# Altium schematic sheet WIF_BT.SchDoc
size A3
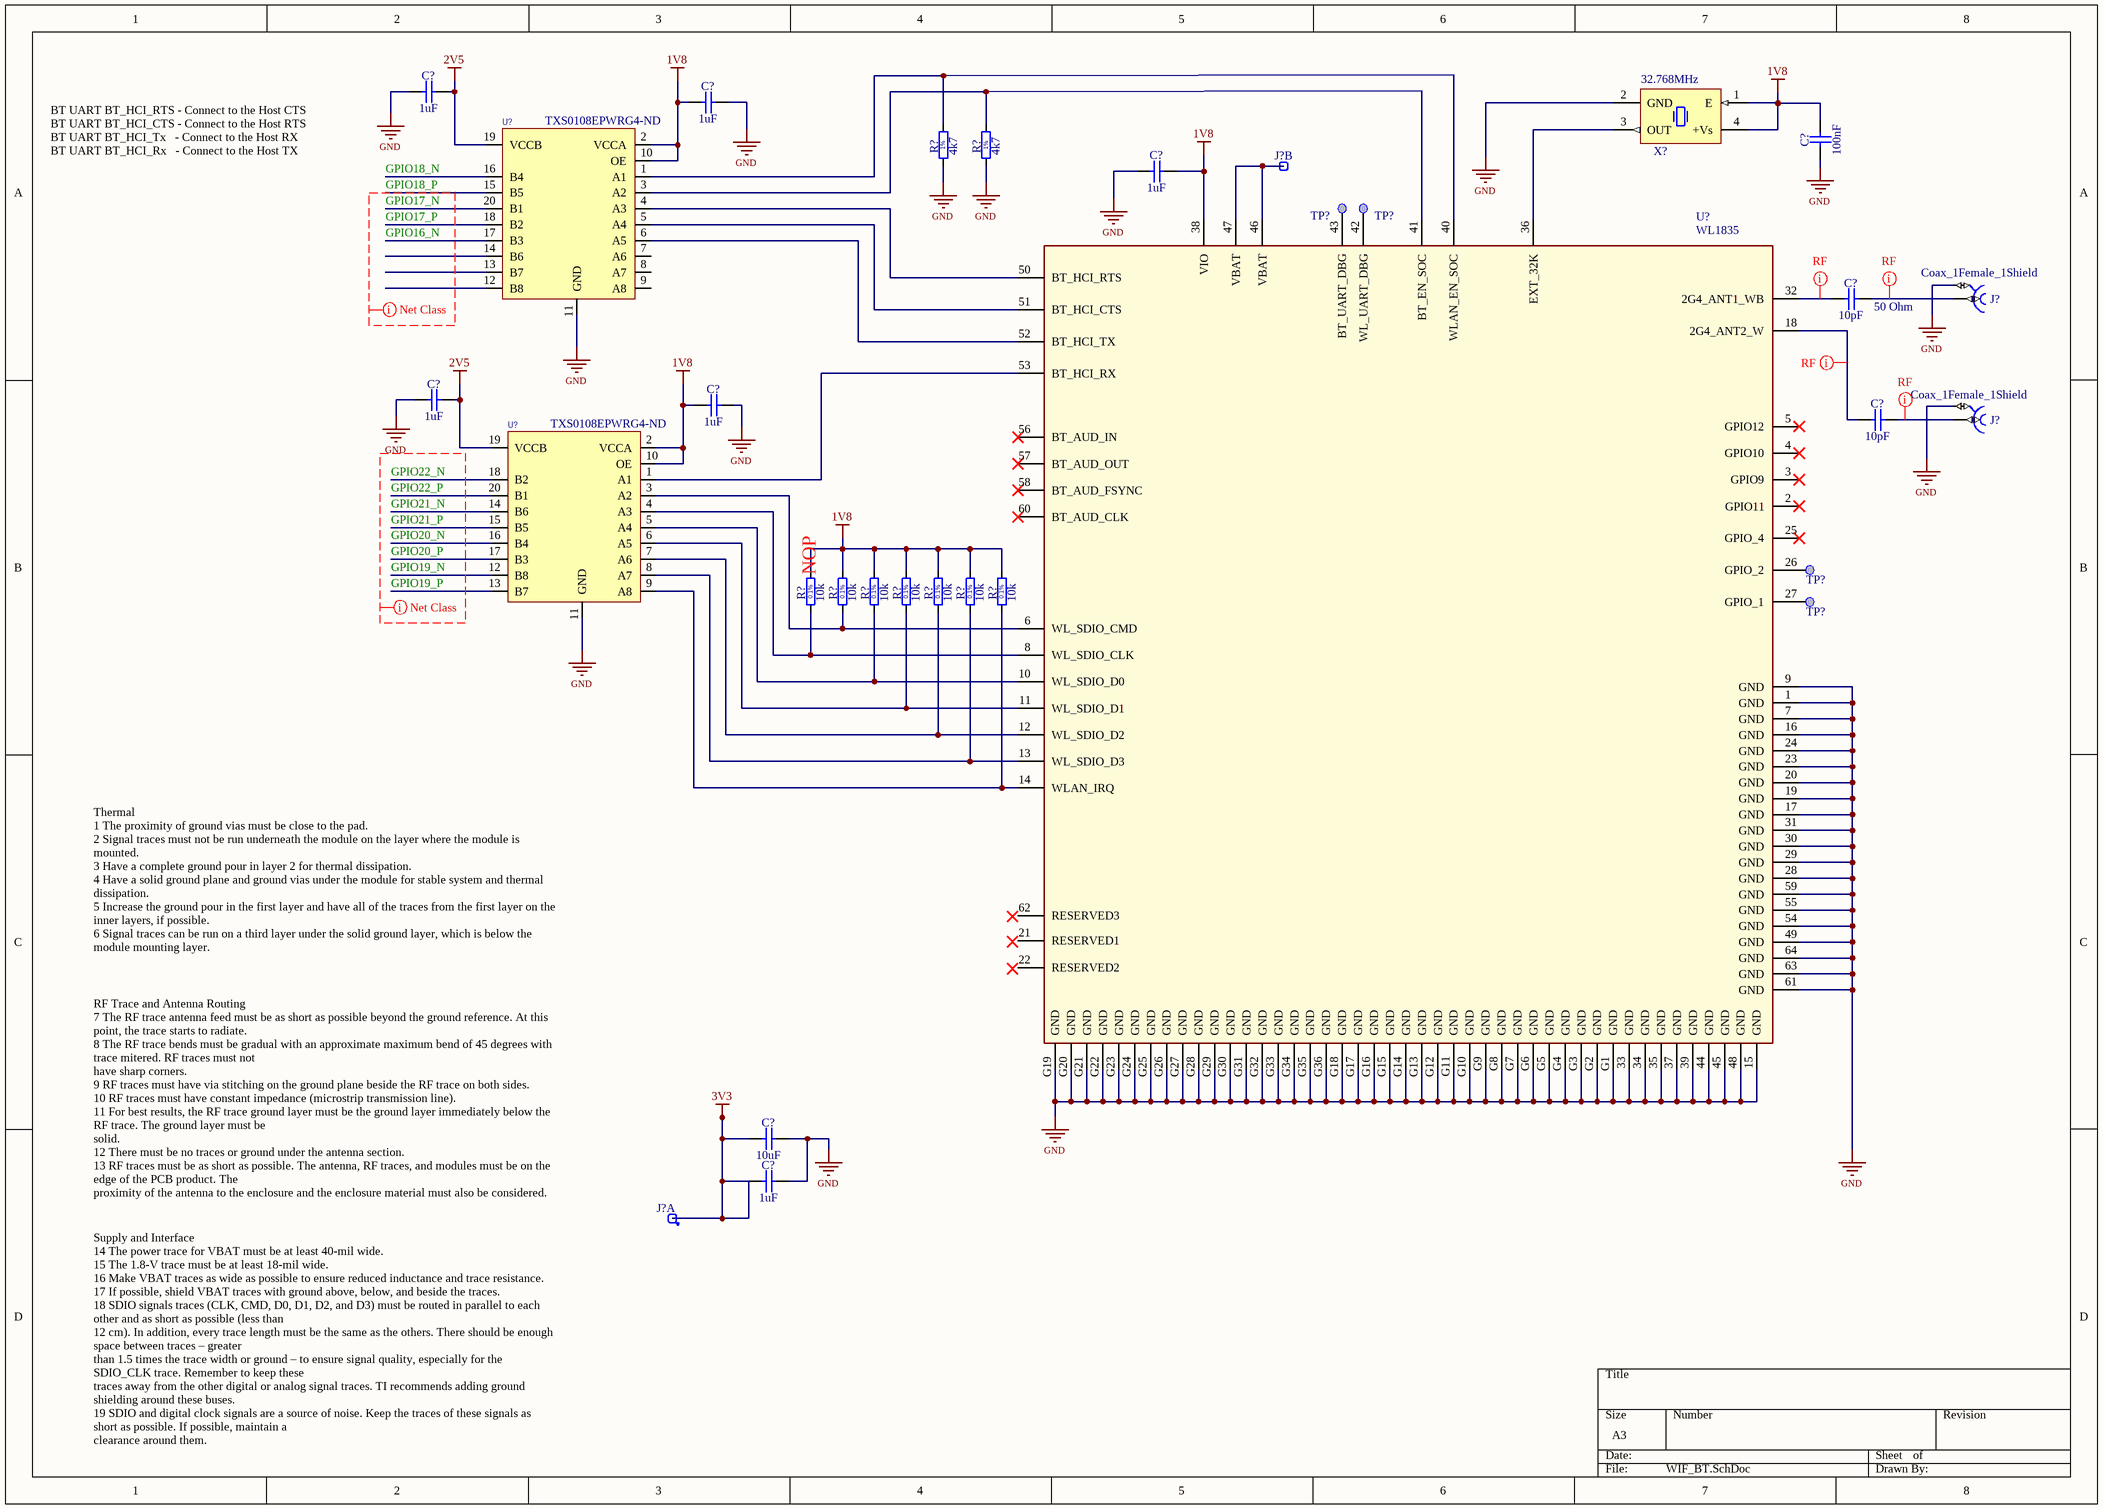
[diagram p0: WIF_BT.SchDoc]

## Parts
(Parts that share a designator on the sheet are numbered #1, #2 ... from top to bottom, then left to right.)
C?#1  1uF  [CAPC1608X87N]
C?#2  1uF  [CAPC1608X87N]
C?#3  100nF  [CAPC1608X87N]
C?#4  1uF  [CAPC1608X87N]
C?#5  10pF  [CAPC1608X87N]
C?#6  1uF  [CAPC1608X87N]
C?#7  1uF  [CAPC1608X87N]
C?#8  10pF  [CAPC1608X87N]
C?#9  10uF  [CAPC2012X135N]
C?#10  1uF  [CAPC1608X87N]
J?#1  Test Point  [COMATEL_385.0358.1.02.400]  (value not drawn)  (part B of 2)
J?#2  Coax_1Female_1Shield  [HUBER-SUHNER_82 SMA-50-0-41/133 NE]
J?#3  Coax_1Female_1Shield  [HUBER-SUHNER_82 SMA-50-0-41/133 NE]
J?#4  Test Point  [COMATEL_385.0358.1.02.400]  (value not drawn)  (part A of 2)
R?#1  4k7  [RESC1608X55N]
R?#2  4k7  [RESC1608X55N]
R?#3  10k  [RESC1608X55N]
R?#4  10k  [RESC1608X55N]
R?#5  10k  [RESC1608X55N]
R?#6  10k  [RESC1608X55N]
R?#7  10k  [RESC1608X55N]
R?#8  10k  [RESC1608X55N]
R?#9  10k  [RESC1608X55N]
TP?#1  TP  [TP]  (value not drawn)  (no BOM)
TP?#2  TP  [TP]  (value not drawn)  (no BOM)
TP?#3  TP  [TP]  (value not drawn)  (no BOM)
TP?#4  TP  [TP]  (value not drawn)  (no BOM)
U?#1  WL1835  [E-13.4X13.3-N100_0.75-TOP]
U?#2  Supplier Part Number: TXS0108EPWRG4-ND  [SOP65P640X120-20N]  (hidden comment: TXS0108EPWR)
U?#3  Supplier Part Number: TXS0108EPWRG4-ND  [SOP65P640X120-20N]  (hidden comment: TXS0108EPWR)
X?  32.768MHz  [OSCSC508P500X700X180-4N]

## Nets
1V8: C?#2.1 C?#3.2 C?#4.2 C?#7.1 R?#3.2 R?#4.2 R?#5.2 R?#6.2 R?#7.2 R?#8.2 R?#9.2 U?#1.38(VIO) U?#2.2(VCCA) U?#2.10(OE) U?#3.2(VCCA) U?#3.10(OE) X?.1(E) X?.4(+Vs)
2V5: C?#1.2 C?#6.2 U?#2.19(VCCB) U?#3.19(VCCB)
3V3: C?#9.1 C?#10.1 J?#4.1
GND: C?#1.1 C?#2.2 C?#3.1 C?#4.1 C?#6.1 C?#7.2 C?#9.2 C?#10.2 J?#2.2 J?#3.2 R?#1.1 R?#2.1 U?#1.1(GND) U?#1.7(GND) U?#1.9(GND) U?#1.15(GND) U?#1.16(GND) U?#1.17(GND) U?#1.19(GND) U?#1.20(GND) U?#1.23(GND) U?#1.24(GND) U?#1.28(GND) U?#1.29(GND) U?#1.30(GND) U?#1.31(GND) U?#1.33(GND) U?#1.34(GND) U?#1.35(GND) U?#1.37(GND) U?#1.39(GND) U?#1.44(GND) U?#1.45(GND) U?#1.48(GND) U?#1.49(GND) U?#1.54(GND) U?#1.55(GND) U?#1.59(GND) U?#1.61(GND) U?#1.63(GND) U?#1.64(GND) U?#1.G1(GND) U?#1.G2(GND) U?#1.G3(GND) U?#1.G4(GND) U?#1.G5(GND) U?#1.G6(GND) U?#1.G7(GND) U?#1.G8(GND) U?#1.G9(GND) U?#1.G10(GND) U?#1.G11(GND) U?#1.G12(GND) U?#1.G13(GND) U?#1.G14(GND) U?#1.G15(GND) U?#1.G16(GND) U?#1.G17(GND) U?#1.G18(GND) U?#1.G19(GND) U?#1.G20(GND) U?#1.G21(GND) U?#1.G22(GND) U?#1.G23(GND) U?#1.G24(GND) U?#1.G25(GND) U?#1.G26(GND) U?#1.G27(GND) U?#1.G28(GND) U?#1.G29(GND) U?#1.G30(GND) U?#1.G31(GND) U?#1.G32(GND) U?#1.G33(GND) U?#1.G34(GND) U?#1.G35(GND) U?#1.G36(GND) U?#2.11(GND) U?#3.11(GND) X?.2(GND)
GPIO16_N: U?#2.17(B3)
GPIO17_N: U?#2.20(B1)
GPIO17_P: U?#2.18(B2)
GPIO18_N: U?#2.16(B4)
GPIO18_P: U?#2.15(B5)
GPIO19_N: U?#3.12(B8)
GPIO19_P: U?#3.13(B7)
GPIO20_N: U?#3.16(B4)
GPIO20_P: U?#3.17(B3)
GPIO21_N: U?#3.14(B6)
GPIO21_P: U?#3.15(B5)
GPIO22_N: U?#3.18(B2)
GPIO22_P: U?#3.20(B1)
NetC?#5_1: C?#5.1 U?#1.32(2G4_ANT1_WB)
NetC?#5_2: C?#5.2 J?#2.1
NetC?#8_1: C?#8.1 U?#1.18(2G4_ANT2_W)
NetC?#8_2: C?#8.2 J?#3.1
NetJ?#1_2: J?#1.2 U?#1.46(VBAT) U?#1.47(VBAT)
NetR?#1_2: R?#1.2 U?#1.40(WLAN_EN_SOC) U?#2.1(A1)
NetR?#2_2: R?#2.2 U?#1.41(BT_EN_SOC) U?#2.3(A2)
NetR?#3_1: R?#3.1 U?#1.8(WL_SDIO_CLK) U?#3.4(A3)
NetR?#4_1: R?#4.1 U?#1.6(WL_SDIO_CMD) U?#3.3(A2)
NetR?#5_1: R?#5.1 U?#1.10(WL_SDIO_D0) U?#3.5(A4)
NetR?#6_1: R?#6.1 U?#1.11(WL_SDIO_D1) U?#3.6(A5)
NetR?#7_1: R?#7.1 U?#1.12(WL_SDIO_D2) U?#3.7(A6)
NetR?#8_1: R?#8.1 U?#1.13(WL_SDIO_D3) U?#3.8(A7)
NetR?#9_1: R?#9.1 U?#1.14(WLAN_IRQ) U?#3.9(A8)
NetTP?#1_1: TP?#1.1 U?#1.43(BT_UART_DBG)
NetTP?#2_1: TP?#2.1 U?#1.42(WL_UART_DBG)
NetTP?#3_1: TP?#3.1 U?#1.26(GPIO_2)
NetTP?#4_1: TP?#4.1 U?#1.27(GPIO_1)
NetU?#1_36: U?#1.36(EXT_32K) X?.3(OUT)
NetU?#1_50: U?#1.50(BT_HCI_RTS) U?#2.4(A3)
NetU?#1_51: U?#1.51(BT_HCI_CTS) U?#2.5(A4)
NetU?#1_52: U?#1.52(BT_HCI_TX) U?#2.6(A5)
NetU?#1_53: U?#1.53(BT_HCI_RX) U?#3.1(A1)

Not connected (* = marked no-connect by the designer): U?#1 2(GPIO11)* 3(GPIO9)* 4(GPIO10)* 5(GPIO12)* 21(RESERVED1) 22(RESERVED2) 25(GPIO_4)* 56(BT_AUD_IN)* 57(BT_AUD_OUT)* 58(BT_AUD_FSYNC)* 60(BT_AUD_CLK)* 62(RESERVED3); U?#2 7(A6) 8(A7) 9(A8) 12(B8) 13(B7) 14(B6)

## Layout directives
net class RF: NetC?#5_1, NetC?#5_2, NetC?#8_1, NetC?#8_2
net class WLAN_SPI: GPIO19_N, GPIO19_P, GPIO20_N, GPIO20_P, GPIO21_N, GPIO21_P, GPIO22_N, GPIO22_P
net class BLU_SPI: GPIO16_N, GPIO17_N, GPIO17_P, GPIO18_P

## Notes on the sheet
- BT UART	BT_HCI_RTS - Connect to the Host CTS
  BT UART	BT_HCI_CTS - Connect to the Host RTS
  BT UART	BT_HCI_Tx   - Connect to the Host RX
  BT UART	BT_HCI_Rx   - Connect to the Host TX
- (near C?#5) 50 Ohm
- (near R?#3) NOP
- Thermal
  1 The proximity of ground vias must be close to the pad.
  2 Signal traces must not be run underneath the module on the layer where the module is mounted.
  3 Have a complete ground pour in layer 2 for thermal dissipation.
  4 Have a solid ground plane and ground vias under the module for stable system and thermal dissipation.
  5 Increase the ground pour in the first layer and have all of the traces from the first layer on the inner layers, if possible.
  6 Signal traces can be run on a third layer under the solid ground layer, which is below the module mounting layer.
- RF Trace and Antenna Routing
  7 The RF trace antenna feed must be as short as possible beyond the ground reference. At this point, the trace starts to radiate.
  8 The RF trace bends must be gradual with an approximate maximum bend of 45 degrees with trace mitered. RF traces must not
  have sharp corners.
  9 RF traces must have via stitching on the ground plane beside the RF trace on both sides.
  10 RF traces must have constant impedance (microstrip transmission line).
  11 For best results, the RF trace ground layer must be the ground layer immediately below the RF trace. The ground layer must be
  solid.
  12 There must be no traces or ground under the antenna section.
  13 RF traces must be as short as possible. The antenna, RF traces, and modules must be on the edge of the PCB product. The
  proximity of the antenna to the enclosure and the enclosure material must also be considered.
- Supply and Interface
  14 The power trace for VBAT must be at least 40-mil wide.
  15 The 1.8-V trace must be at least 18-mil wide.
  16 Make VBAT traces as wide as possible to ensure reduced inductance and trace resistance.
  17 If possible, shield VBAT traces with ground above, below, and beside the traces.
  18 SDIO signals traces (CLK, CMD, D0, D1, D2, and D3) must be routed in parallel to each other and as short as possible (less than
  12 cm). In addition, every trace length must be the same as the others. There should be enough space between traces – greater
  than 1.5 times the trace width or ground – to ensure signal quality, especially for the SDIO_CLK trace. Remember to keep these
  traces away from the other digital or analog signal traces. TI recommends adding ground shielding around these buses.
  19 SDIO and digital clock signals are a source of noise. Keep the traces of these signals as short as possible. If possible, maintain a
  clearance around them.
- (in symbol R0603_4K7_1%_0.1W_100PPM) 1%
- (in symbol R0603_10K_0.1%_0.063W_10PPM) 0.1%

## Library data of the parts
C?#1 C?#2 C?#4 C?#6 C?#7 C?#10 = CC0603_1UF_25V_10%_X7R: Non-polarised capacitor; Part Description: SMD Multilayer Chip Ceramic Capacitor; Manufacturer: MULTICOMP; Manufacturer Part Number: MC0603F104Z250CT; Manufacturer1 Part Number: GRM188R71E105KA12D; Voltage: 25V; TC: X7R; Tolerance: ±10%; Table: Capacitors SMD; Capacitance: 0.1; Capacitance Tolerance: +80%, -20%; No. of Pins: 2; Product Range: MC Series; External Length / Height: 0.8; Dielectric Characteristic: Y5; Ceramic Capacitor Case: 0603 [1608 Metric]; Capacitor Terminals: SMD; External Depth: 1.6; SVHC: No SVHC (17-Dec-2015); Voltage Rating: 25; Part Number: CC0603_1UF_25V_10%_X7R; Component Kind: Standard; Component Type: Standard; Pin Count: 2; Value: 1uF; Status: None; Case: 0603; Mounted: Yes; Socket: No; SMD: Yes; Manufacturer1 Example: MURATA; Manufacturer1 ComponentHeight: 0.9mm; HelpURL: \\cern.ch\dfs\Applications\Altium\Datasheets\CC0603_X7R_MURATA.pdf; Author: CERN DEM JLC; CreateDate: 18.01.2011; LatestRevisionDate: 18.01.2011; MSL: -; Supplier Part Number: 1759038; Capacitance Tolerance ±: +80%, -20%; External Width: 0.8; Operating Temperature Range: -25°C to +85°C<!--FANDB--><div class="features-and-benefits-container"><div class="features-and-benefits-description"><span class="features-benefits-value">The MC0603F104Z250CT is a general purpose Multilayer Ceramic Capacitor with Cu/Ni/Sn-plated termination, Y5V dielectric and 0603 case. The multilayer ceramic capacitor consists of a conducting material and electrodes. To manufacture a chip-type SMT and achieve miniaturization, high density and high efficiency, ceramic condensers are used. High electrical precision, stability and reliability.</span></div><div class="features-and-benefits-list"><ul class="features-and-benefits-list-list"><li class="features-and-benefits-list-item">High capacitance</li></ul></div><div class="features-and-benefits-applications"><ul class="features-and-benefits-value"><li class="features-and-benefits-list-item">Power Management</li><li class="features-and-benefits-list-item">Consumer Electronics</li><li class="features-and-benefits-list-item">Communications & Networking</li></ul></div></div>; Supplier: Farnell; Packaging: Cut Tape; Operating Temperature Max: 85; Operating Temperature Min: -30; RoHS: YES
C?#3 = CC0603_100NF_50V_10%_X7R: Non-polarised capacitor; Part Description: SMD Multilayer Chip Ceramic Capacitor; Manufacturer: MULTICOMP; Manufacturer Part Number: MCB0603R104KCT; Manufacturer1 Part Number: 223858615649; Voltage: 50V; TC: X7R; Tolerance: ±10%; Table: Capacitors SMD; Voltage Rating: 16; Capacitance Tolerance ±: ± 10%; Dielectric Characteristic: X7; Capacitance: 0.1; SVHC: No SVHC (17-Dec-2015); Capacitor Terminals: SMD; Ceramic Capacitor Case: 0603 [1608 Metric]; Product Range: MCB Series; Part Number: CC0603_100NF_50V_10%_X7R; Component Kind: Standard; Component Type: Standard; Pin Count: 2; Value: 100nF; Status: Preferred; Case: 0603; Mounted: Yes; Socket: No; SMD: Yes; Manufacturer1 Example: PHYCOMP; Manufacturer1 ComponentHeight: 0.87mm; HelpURL: \\cern.ch\dfs\Applications\Altium\Datasheets\CC0603_X7R_PHYCOMP.pdf; Author: CERN DEM JLC; CreateDate: 03.12.2007; LatestRevisionDate: 03.12.2007; Supplier: Farnell; Capacitance Tolerance: ± 10%; Supplier Part Number: 9406140; RoHS: YES; Packaging: Cut Tape; MSL: -; Operating Temperature Max: 125; Operating Temperature Range: -55°C to +125°C<!--FANDB--><div class="features-and-benefits-container"><div class="features-and-benefits-description"><span class="features-benefits-value">The MCB0603R104KCT is a multilayer Ceramic Capacitor with 0603 chip, for general digital circuit. Consists of a conducting material and electrodes. To manufacture a chip-type SMT and achieve miniaturization, high density and high efficiency, ceramic condensers are used. MLCC is made by X7; Operating Temperature Min: -55
C?#5 C?#8 = CC0603_10PF_50V_5%_NP0: Non-polarised capacitor; Part Description: SMD Multilayer Chip Ceramic Capacitor; Manufacturer: Yageo; Manufacturer Part Number: CC0603JRNPO9BN100; Manufacturer1 Part Number: 223886715109; Voltage: 50V; TC: NP0; Tolerance: ±5%; Table: Capacitors SMD; Temperature Coefficient: C0G, NP0; Part Number: CC0603_10PF_50V_5%_NP0; Component Kind: Standard; Component Type: Standard; Pin Count: 2; Value: 10pF; Status: Preferred; Case: 0603; Mounted: Yes; Socket: No; SMD: Yes; Manufacturer1 Example: PHYCOMP; Manufacturer1 ComponentHeight: 0.87mm; HelpURL: \\cern.ch\dfs\Applications\Altium\Datasheets\CC0603_NP0_PHYCOMP.pdf; Author: CERN DEM JLC; CreateDate: 3.12.2007; LatestRevisionDate: 3.12.2007; Packaging: Tape & Reel (TR); Features: -; RoHS: RoHS Compliant; Applications: General Purpose; Category: Capacitors; Operating Temperature: -55°C ~ 125°C; Height - Seated (Max): -; Supplier Part Number: 311-1058-2-ND; Ratings: -; Lead Style: -; Thickness (Max): 0.035" (0.90mm); Lead Spacing: -; Mounting Type: Surface Mount, MLCC; Size / Dimension: 0.063" L x 0.031" W (1.60mm x 0.80mm); Voltage - Rated: 50V; Supplier: Digi-Key; Package / Case: 0603 (1608 Metric); Capacitance: 10pF
C?#9 = CC0805_10UF_10V_10%_X7R: Non-polarised capacitor; Part Description: SMD Multilayer Chip Ceramic Capacitor; Manufacturer: MULTICOMP; Manufacturer Part Number: MC0805X106K250CT; Manufacturer1 Part Number: GRM21BR71A106KE51L; Voltage: 10V; TC: X7R; Tolerance: ±10%; Table: Capacitors SMD; Product Range: MC Series; Voltage Rating: 25; Capacitor Terminals: SMD<!--FANDB--><div class="features-and-benefits-container"><div class="features-and-benefits-description"><span class="features-benefits-value">The MC series from Multicomp are general purpose MLCC capacitors with X5R dielectric material which provides high electrical precision, stability and reliability. This MLCC capacitor consists of a conducting material and electrodes with high density and high efficiency ceramic condensers.</span></div><div class="features-and-benefits-list"><ul class="features-and-benefits-list-list"><li class="features-and-benefits-list-item">Small size with higher capacitance values</li><li class="features-and-benefits-list-item">0201, 0402, 0603, 0805, 1206, 1210, 1812 case sizes available</li><li class="features-and-benefits-list-item">Capacitance values ranges from 100pF to 220?F</li><li class="features-and-benefits-list-item">Capacitor with lead free termination (pure Tin)</li><li class="features-and-benefits-list-item">High electrical precision, stability and reliability</li><li class="features-and-benefits-list-item">Rated voltage of 4V, 6.3V, 10V, 16V, 25V, 50V</li><li class="features-and-benefits-list-item">Operating temperature range -55°C to +85°C</li><li class="features-and-benefits-list-item">Available in ±10% and ±20; Dielectric Characteristic: X5; Ceramic Capacitor Case: 0805 [2012 Metric]; Capacitance Tolerance ±: ± 10%; SVHC: No SVHC (15-Jun-2015); Capacitance: 10; Part Number: CC0805_10UF_10V_10%_X7R; Component Kind: Standard; Component Type: Standard; Pin Count: 2; Value: 10uF; Status: Preferred; Case: 0805; Mounted: Yes; Socket: No; SMD: Yes; Manufacturer1 Example: MURATA; Manufacturer1 ComponentHeight: 1.35mm; HelpURL: \\cern.ch\dfs\Applications\Altium\Datasheets\CC0805_X7R_MURATA.pdf; Author: CERN DEM JLC; CreateDate: 30.04.2012; LatestRevisionDate: 30.04.2012; Operating Temperature Min: -55; MSL: MSL 1 - Unlimited; Supplier: Farnell; RoHS: YES; Capacitance Tolerance: ± 10%; Packaging: Cut Tape; Supplier Part Number: 2320833; Operating Temperature Max: 85
J?#1 J?#4 = COMATEL_385.0358.1.02.400: 2 Mini Wire-Wrap Contact Strip Header; Part Description: 2 Contacts Straight Strip Header Pitch 2.54mm L=6.3mm ''Mini-Wire-Wrap''; Manufacturer: KONTEK COMATEL; Part Number: COMATEL_385.0358.1.02.400; Component Kind: Standard; Component Type: Standard; Pin Count: 2; Family: Test Point; Mounted: Yes; Socket: No; SMD: No; Status: Not recommended; Manufacturer Part Number: 385.0358.1.02.400; ComponentHeight: 8mm; HelpURL: \\cern.ch\dfs\Applications\Altium\Datasheets\COMATEL_385.0358.1.02.400.pdf; Author: CERN DEM JLC; CreateDate: 30.06.2010; LatestRevisionDate: 10.10.2012; Table: COMATEL
J?#2 J?#3 = HUBER-SUHNER_82_SMA-50-0-41/133_NE: Part Description: SMA 50 Ohms Straight PCB Jack; Manufacturer: AMPHENOL CONNEX; Manufacturer Part Number: 132134; Table: Miscellaneous; Part Number: HUBER-SUHNER_82_SMA-50-0-41/133_NE; Component Kind: Standard; Component Type: Standard; Pin Count: 2; Family: SMA; Mounted: Yes; Socket: No; SMD: No; Status: None; ComponentHeight: 9.6mm; HelpURL: \\cern.ch\dfs\Applications\Altium\Datasheets\HUBER-SUHNER_82 SMA-50-0-41-133 NE.pdf; Author: CERN DEM JLC; CreateDate: 20.04.2010; LatestRevisionDate: 27.04.2010; Supplier: Farnell; RoHS: YES; Supplier Part Number: 2112465
R?#1 R?#2 = R0603_4K7_1%_0.1W_100PPM: Resistor - 1%; Part Description: General Purpose Thick Film Chip Resistor; Manufacturer: Yageo; Manufacturer Part Number: RC0603JR-074K7L; Manufacturer1 Part Number: NRC06F4701TRF; Power: 0.1W; TC: ±100ppm/°C; Tolerance: ±5%; Table: Resistors SMD; Resistance (Ohms): 4.7k; Power (Watts): 0.1W, 1/10W; Part Number: R0603_4K7_1%_0.1W_100PPM; Component Kind: Standard; Component Type: Standard; Pin Count: 2; Value: 4k7; Status: Preferred; Case: 0603; Mounted: Yes; Socket: No; SMD: Yes; Manufacturer1 Example: NIC COMPONENT; Manufacturer1 ComponentHeight: 0.55mm; HelpURL: \\cern.ch\dfs\Applications\Altium\Datasheets\R0603_NIC_NRC.pdf; Author: CERN DEM JLC; CreateDate: 3.12.2007; LatestRevisionDate: 13.03.2008; Size / Dimension: 0.063" L x 0.031" W (1.60mm x 0.80mm); Supplier Device Package: 0603; Supplier: Digi-Key; Features: Moisture Resistant; Package / Case: 0603 (1608 Metric); Category: Resistors; Temperature Coefficient: ±100ppm/°C; Number of Terminations: 2; Packaging: Cut Tape (CT); Height: 0.022" (0.55mm); Composition: Thick Film; RoHS: RoHS Compliant; Operating Temperature: -55°C ~ 155°C; Supplier Part Number: 311-4.7KGRCT-ND
R?#3-R?#9 = R0603_10K_0.1%_0.063W_10PPM: Resistor - 0.1%; Part Description: Thin Film Chip Resistor; Manufacturer: Panasonic Electronic Components; Manufacturer Part Number: ERJ-3GEYJ103V; Manufacturer1 Part Number: RN73C1J10KBTDF; Power: 0.063W; TC: ±10ppm; Tolerance: ±5%; Table: Resistors SMD; Temperature Coefficient: ±200ppm/°C; Power (Watts): 0.1W, 1/10W; Part Number: R0603_10K_0.1%_0.063W_10PPM; Component Kind: Standard; Component Type: Standard; Pin Count: 2; Value: 10k; Status: Not recommended; Case: 0603; Mounted: Yes; Socket: No; SMD: Yes; Manufacturer1 Example: TYCO HOLSWORTHY; Manufacturer1 ComponentHeight: 0.5mm; HelpURL: \\cern.ch\dfs\Applications\Altium\Datasheets\R0603_Tyco_RN73.pdf; Author: CERN DEM JLC; CreateDate: 3.12.2007; LatestRevisionDate: 13.03.2008; Supplier: Digi-Key; Supplier Part Number: P10KGDKR-ND; Category: Resistors; Height: 0.022" (0.55mm); Operating Temperature: -55°C ~ 155°C; Number of Terminations: 2; Composition: Thick Film; Features: Automotive AEC-Q200; RoHS: RoHS Compliant; Supplier Device Package: 0603; Size / Dimension: 0.063" L x 0.031" W (1.60mm x 0.80mm); Packaging: Digi-Reel®; Resistance (Ohms): 10k; Package / Case: 0603 (1608 Metric)
TP?#1-TP?#4 = Test Point
U?#1 = WL1835: MODULE WIFI WILINK; Manufacturer Part Number: WL1835MODGBMOCR; Manufacturer: Texas Instruments; Voltage - Supply: 2.9 V ~ 4.8 V; Power - Output: 17.3dBm; Sensitivity: -96.3dBm; Protocol: 802.11a/b/g/n, Bluetooth v4.1 Low Energy (BLE); Frequency: 2.4GHz ~ 2.48GHz; Current - Receiving: 85mA; Data Rate: 100Mbps; RF Family/Standard: Bluetooth, WiFi; Current - Transmitting: 420mA; Antenna Type: Integrated, Chip; Serial Interfaces: UART; Category: RF/IF and RFID; Modulation: -; Memory Size: -; Supplier: Digi-Key; RoHS: RoHS Compliant By Exemption; Packaging: Tape & Reel (TR); Package / Case: Module; Operating Temperature: -40°C ~ 85°C; Mounting Type: Surface Mount; Supplier Part Number: 296-38032-2-ND
U?#2 U?#3 = TXS0108EPWR: IC 8BIT NON-INV TRANSLTR 20TSSOP; Manufacturer Part Number: TXS0108EPWRG4; Manufacturer: Texas Instruments; Voltage - VCCA: 1.2 V ~ 3.6 V; Channels per Circuit: 8; Output Type: Open Drain, Push-Pull; Channel Type: Bidirectional; Data Rate: 60Mbps; Voltage - VCCB: 1.65 V ~ 5.5 V; Number of Circuits: 1; Translator Type: Voltage Level; Features: Auto-Direction Sensing; Mounting Type: Surface Mount; Output Signal: -; RoHS: RoHS Compliant; Input Signal: -; Packaging: Tape & Reel (TR); Operating Temperature: -40°C ~ 85°C (TA); Supplier: Digi-Key; Category: Integrated Circuits (ICs); Package / Case: 20-TSSOP (0.173", 4.40mm Width); Supplier Device Package: 20-TSSOP
X? = OSC_32.7688MHZ_RAKON_LF SPXO019203: Oscillator 4 pins 1=E 2=GND 3=OUT 4=+Vs; Part Description: 3.3V ±50ppm Tri-State Surface Mount HCCMOS Clock Oscillator (CFPS-73 Serie); Manufacturer: EPSON; Manufacturer Part Number: SG-3030JF 32.7680KB0: ROHS; Table: Crystals & Oscillators; Frequency: 32.768kHz; Output: CMOS; Voltage - Supply: 1.5 V ~ 5.5 V; Current - Supply (Max): 2µA; Part Number: OSC_32.7688MHZ_RAKON_LF SPXO019203; Component Kind: Standard; Component Type: Standard; PackageDescription: SMD Oscillator, side convave, 4 pins, 5.00x7.00mm; Value: 32.768MHz; Pin Count: 4; Mounted: Yes; Socket: No; SMD: Yes; ComponentHeight: 2mm; HelpURL: \\cern.ch\dfs\Applications\Altium\Datasheets\OSC_RAKON_CFPS.pdf; Author: CERN DEM JLC; CreateDate: 5.10.2009; LatestRevisionDate: 5.10.2009; Category: Crystals and Oscillators; Supplier Part Number: SG-3030JF 32.7680KB0: ROHS-ND; Supplier: Digi-Key; RoHS: RoHS Compliant; Packaging: Tape & Reel (TR); Type: XO (Standard); Function: -; Frequency Stability: -; Operating Temperature: -20°C ~ 70°C; Ratings: -; Mounting Type: Surface Mount; Size / Dimension: 0.280" L x 0.181" W (7.10mm x 4.60mm); Height: 0.059" (1.50mm); Package / Case: 4-SOJ; Current - Supply (Disable) (Max): -